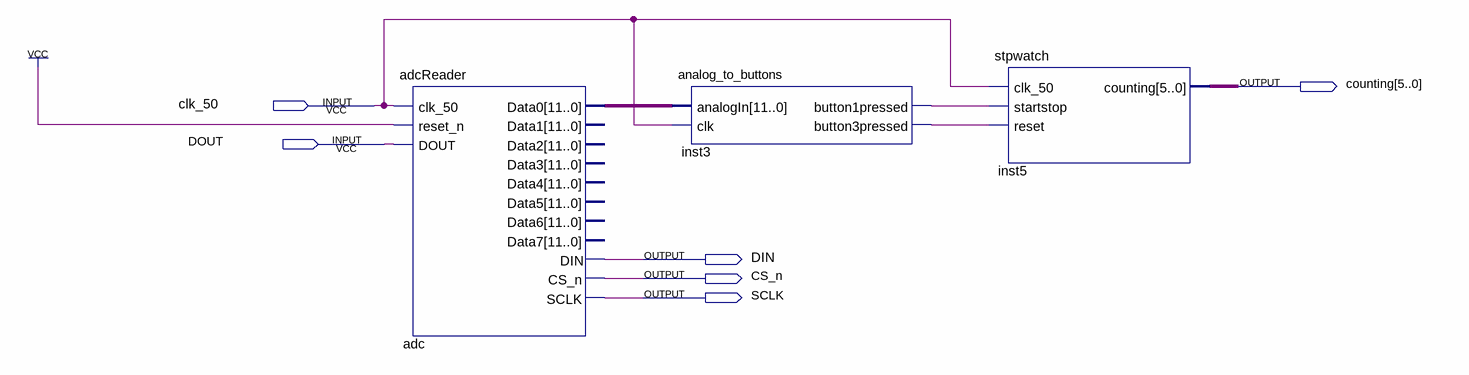
[diagram p0: schematic sheet]
// Quartus schematic Stoppuhr.bdf as structural Verilog: 3 symbols, 6 pins
module Stoppuhr (
  input  clk_50,
  input  DOUT,
  output [5:0] counting,
  output DIN,
  output CS_n,
  output SCLK
);

  wire inst3_button1pressed, inst3_button3pressed;
  wire [11:0] adc_data0;

  adcReader adc (
    .clk_50(clk_50), .reset_n(1'b1), .DOUT(DOUT), .Data0(adc_data0), .DIN(DIN), .CS_n(CS_n), .SCLK(SCLK));  // open: Data1, Data2, Data3, Data4, Data5, Data6, Data7
  analog_to_buttons inst3 (
    .analogIn(adc_data0), .clk(clk_50), .button1pressed(inst3_button1pressed),
    .button3pressed(inst3_button3pressed));
  stpwatch inst5 (.clk_50(clk_50), .startstop(inst3_button1pressed), .reset(inst3_button3pressed), .counting(counting));
endmodule
